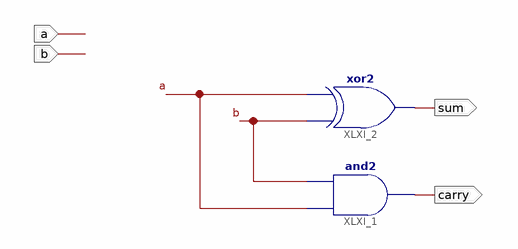
[diagram p0: schematic sheet 1]
// Xilinx ISE schematic halfadder_sc.sch (spartan6) as structural Verilog: 2 symbols, 4 ports
module halfadder_sc (
  input  a,
  input  b,
  output sum,
  output carry
);

  and XLXI_1 (carry, a, b);
  xor XLXI_2 (sum, b, a);
endmodule
